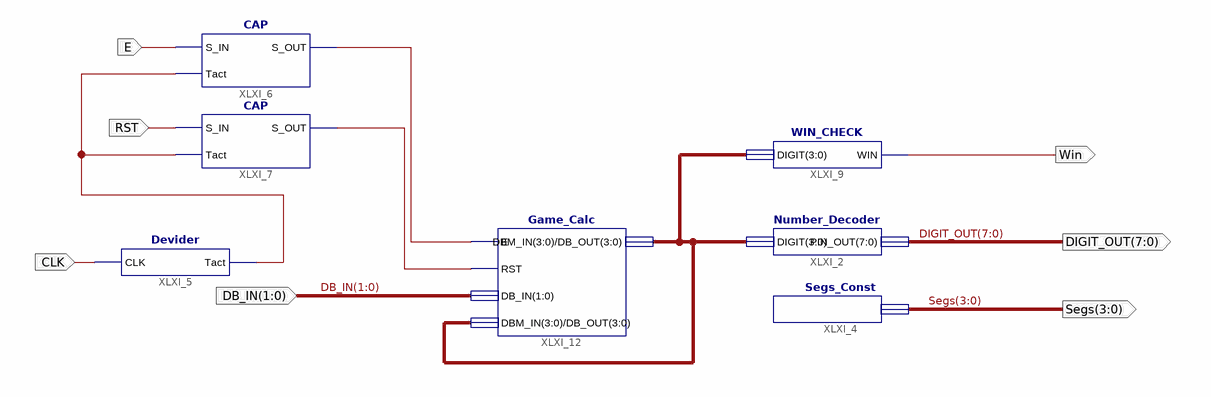
[diagram p0: schematic sheet 1]
// Xilinx ISE schematic Scheme.sch (spartan6) as structural Verilog: 7 symbols, 7 ports
module Scheme (
  input  CLK,
  input  RST,
  input  E,
  input  [1:0] DB_IN,
  output [7:0] DIGIT_OUT,
  output [3:0] Segs,
  output Win
);

  wire XLXN_13, XLXN_32, XLXN_33;
  wire [3:0] XLXN_29;

  Number_Decoder XLXI_2 (.DIGIT(XLXN_29), .PIN_OUT(DIGIT_OUT));
  Segs_Const XLXI_4 (.Segs(Segs));
  Devider XLXI_5 (.CLK(CLK), .Tact(XLXN_13));
  CAP XLXI_6 (.S_IN(E), .Tact(XLXN_13), .S_OUT(XLXN_33));
  CAP XLXI_7 (.S_IN(RST), .Tact(XLXN_13), .S_OUT(XLXN_32));
  WIN_CHECK XLXI_9 (.DIGIT(XLXN_29), .WIN(Win));
  Game_Calc XLXI_12 (.E(XLXN_33), .RST(XLXN_32), .DB_IN(DB_IN), .DBM_IN(XLXN_29), .DB_OUT(XLXN_29));
endmodule
